# EAGLE board RaspFPGA (EAGLE 6.1), part 1 of 3
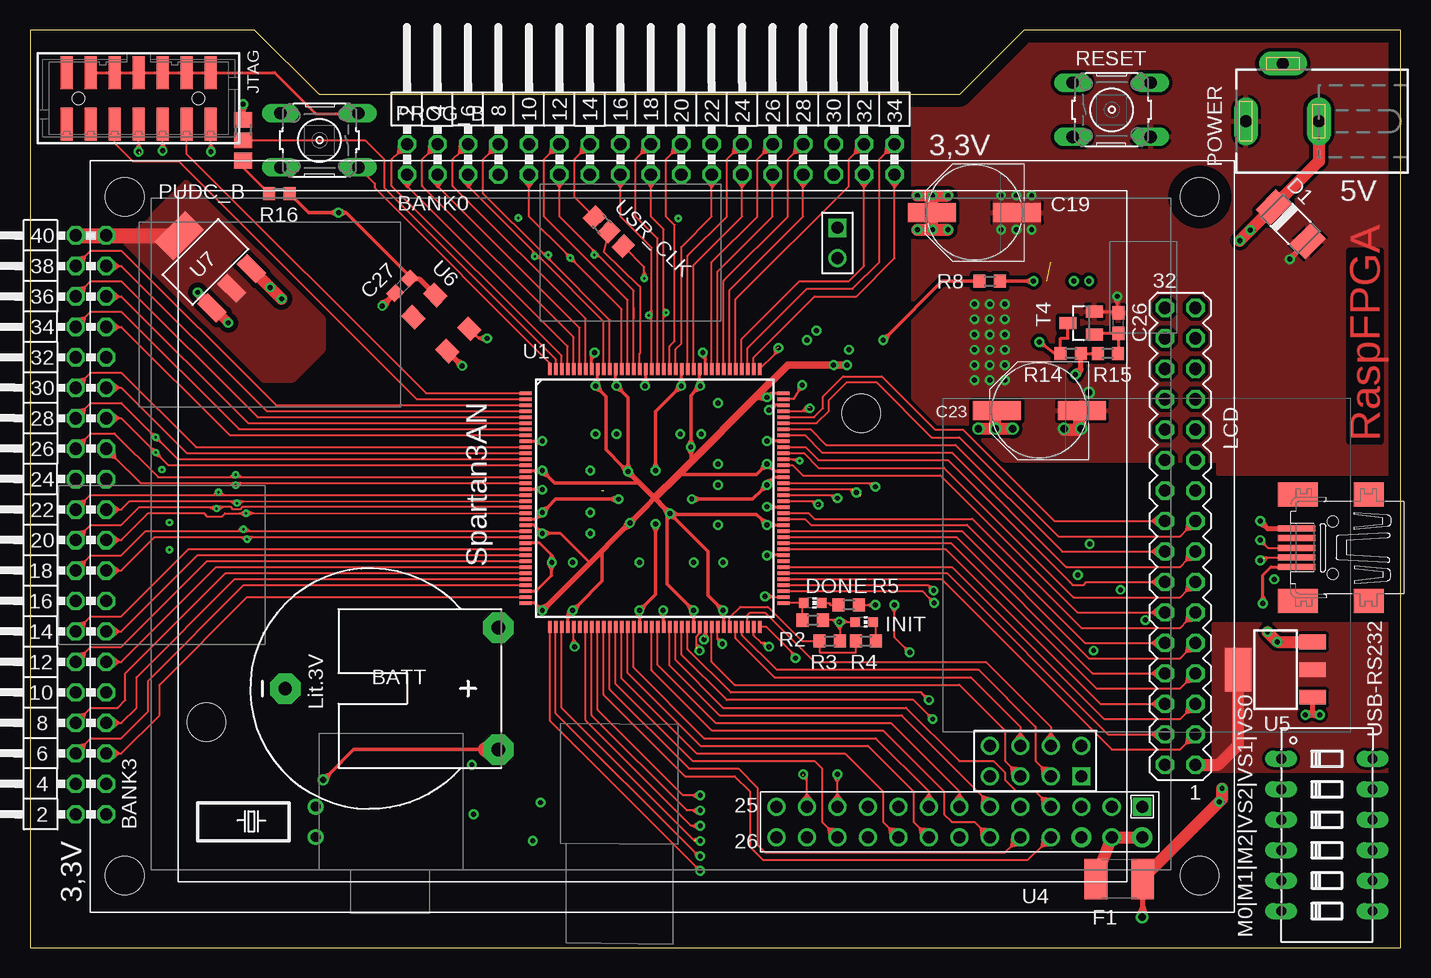
[diagram p5: board, top side]
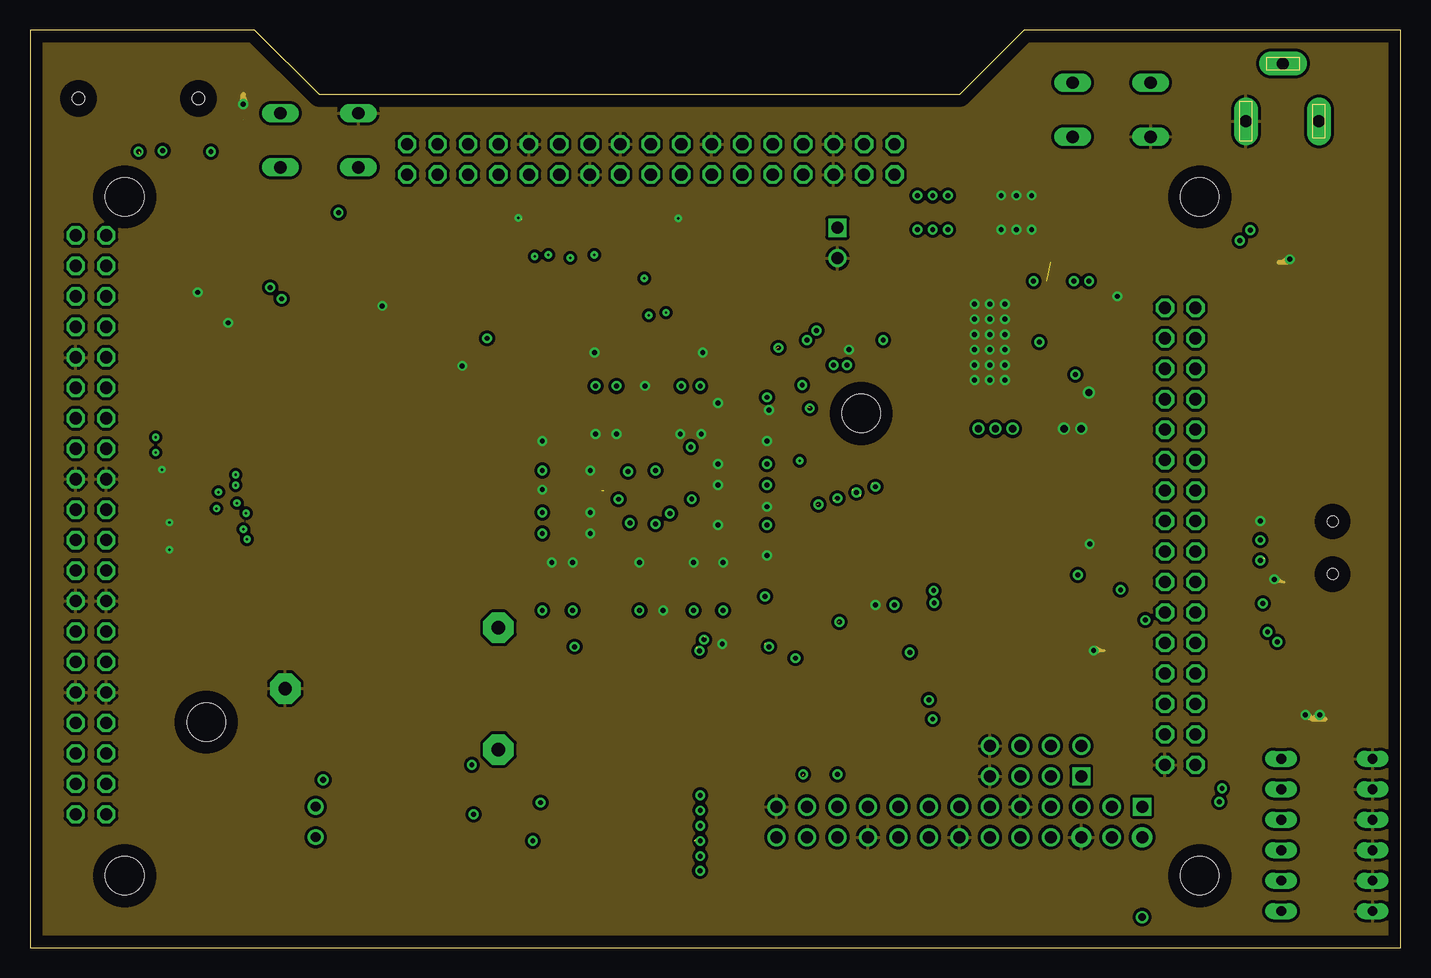
[diagram p6: board, inner layer GND]
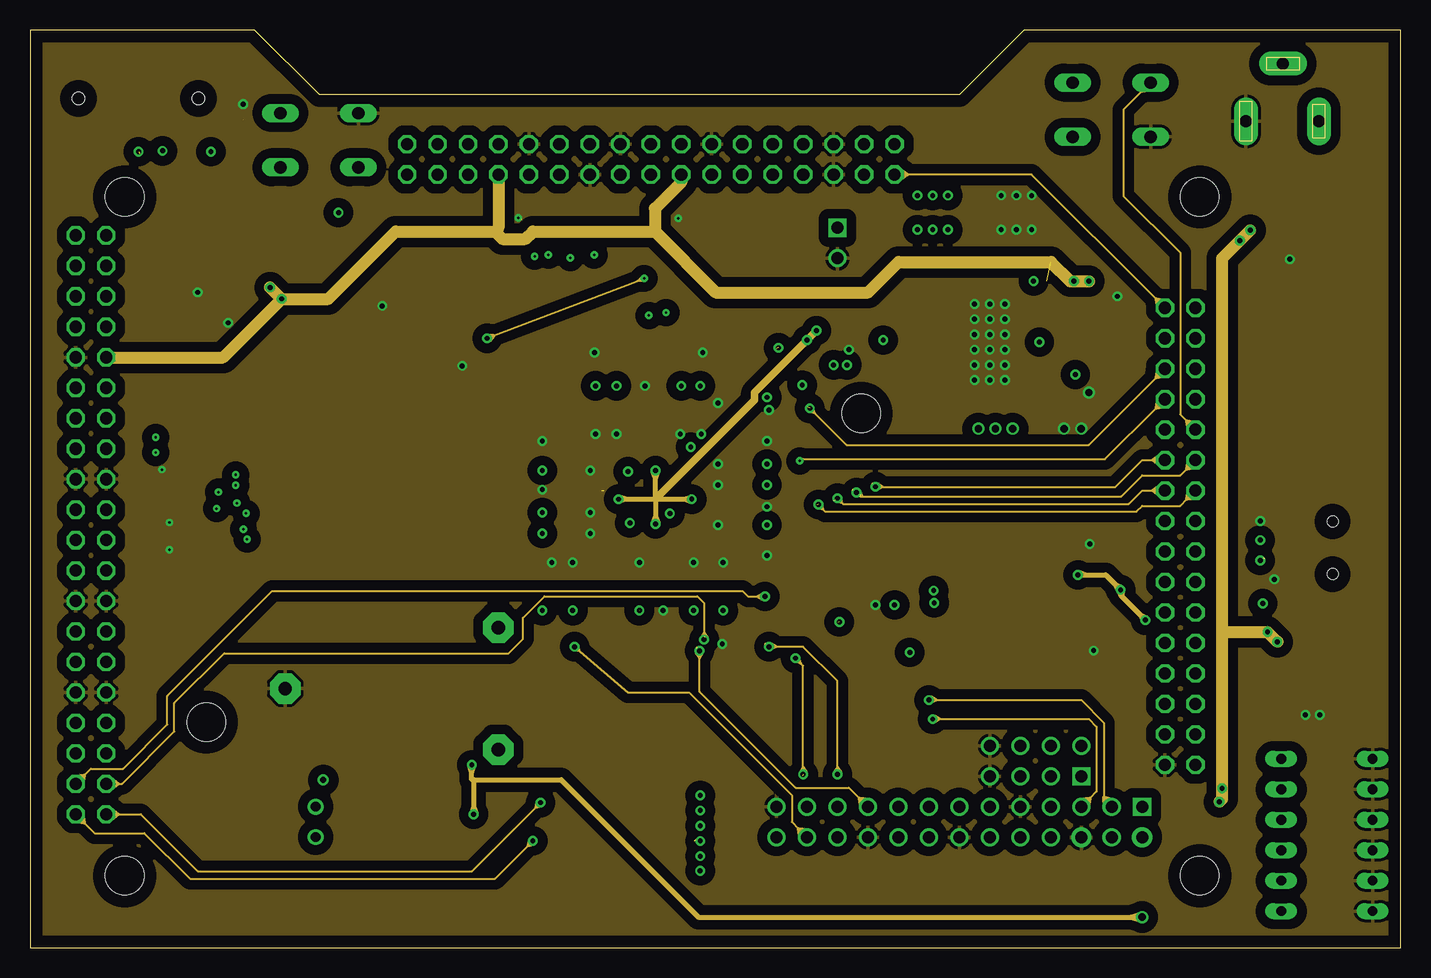
[diagram p7: board, inner layer Signal]
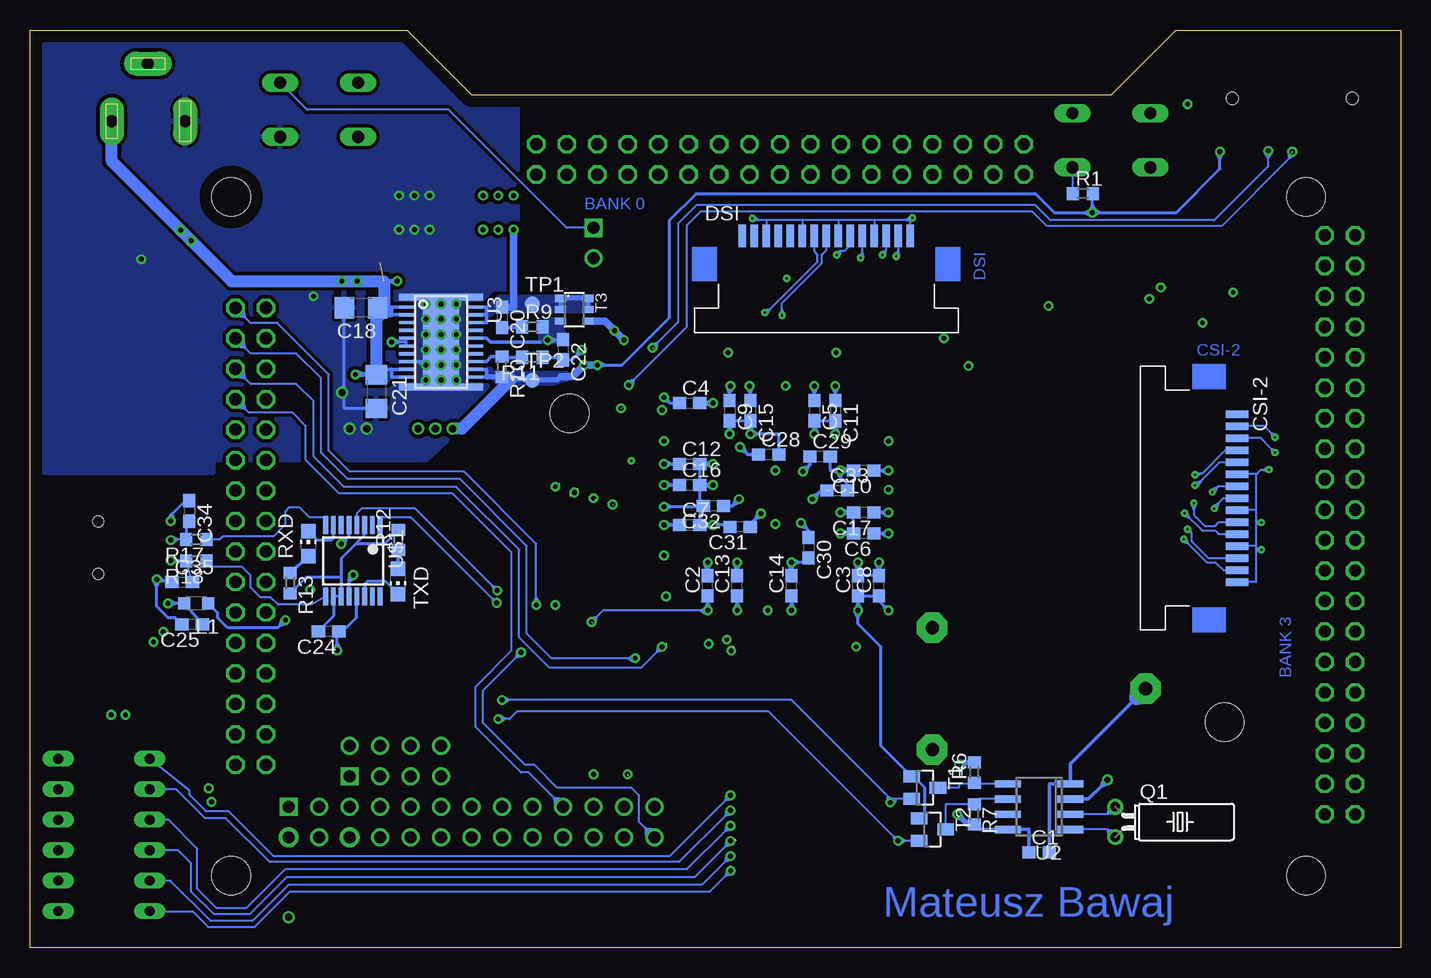
[diagram p8: board, bottom side, seen from below]

Size 114.28 x 76.5 mm. Coordinates in mm from the lower left corner, seen from the top.
Outline: 0,0 114.28,0 114.28,76.5 82.85,76.5 77.47,71.12 24.13,71.12 18.74,76.5 0,76.5 0,0
Copper layers (1*2*15*16): Top 0.035mm / dielectric 0.47mm / GND 0.035mm / dielectric 0.47mm / Signal 0.035mm / dielectric 0.47mm / Bottom 0.035mm
Design rules: minimum track width 5mil, minimum drill 8mil, track to track 5mil, track to pad 5mil, pad to pad 5mil, via to via 5mil, smd to smd 5mil, copper to edge 40mil, drill to drill 8mil, minimum pad ring 10mil, minimum via ring 8mil, stop-mask expansion 4mil, vias tented up to drill 0mil, thermal gap 10mil

## Footprints (pad centres in the part's own frame; a part is rotated, then mirrored left to right if it is on the bottom)
MA17-2W = drill 1.016 octagon: 1 -20.32,-1.27; 2 -20.32,1.27; 3 -17.78,-1.27; 4 -17.78,1.27; 5 -15.24,-1.27; 6 -15.24,1.27; 7 -12.7,-1.27; 8 -12.7,1.27; 9 -10.16,-1.27; 10 -10.16,1.27; 11 -7.62,-1.27; 12 -7.62,1.27; 13 -5.08,-1.27; 14 -5.08,1.27; 15 -2.54,-1.27; 16 -2.54,1.27; 17 0,-1.27; 18 0,1.27; 19 2.54,-1.27; 20 2.54,1.27; 21 5.08,-1.27; 22 5.08,1.27; 23 7.62,-1.27; 24 7.62,1.27; 25 10.16,-1.27; 26 10.16,1.27; 27 12.7,-1.27; 28 12.7,1.27; 29 15.24,-1.27; 30 15.24,1.27; 31 17.78,-1.27; 32 17.78,1.27; 33 20.32,-1.27; 34 20.32,1.27
MA20-2W = drill 1.016 octagon: 1 -24.13,-1.27; 2 -24.13,1.27; 3 -21.59,-1.27; 4 -21.59,1.27; 5 -19.05,-1.27; 6 -19.05,1.27; 7 -16.51,-1.27; 8 -16.51,1.27; 9 -13.97,-1.27; 10 -13.97,1.27; 11 -11.43,-1.27; 12 -11.43,1.27; 13 -8.89,-1.27; 14 -8.89,1.27; 15 -6.35,-1.27; 16 -6.35,1.27; 17 -3.81,-1.27; 18 -3.81,1.27; 19 -1.27,-1.27; 20 -1.27,1.27; 21 1.27,-1.27; 22 1.27,1.27; 23 3.81,-1.27; 24 3.81,1.27; 25 6.35,-1.27; 26 6.35,1.27; 27 8.89,-1.27; 28 8.89,1.27; 29 11.43,-1.27; 30 11.43,1.27; 31 13.97,-1.27; 32 13.97,1.27; 33 16.51,-1.27; 34 16.51,1.27; 35 19.05,-1.27; 36 19.05,1.27; 37 21.59,-1.27; 38 21.59,1.27; 39 24.13,-1.27; 40 24.13,1.27
CR2032H = drill 1.118 pad 2.54 octagon: + 5.08,10.795; +@1 -5.08,10.795; - 0,-6.985
C0603 = smd 1.1 x 1: 1 -0.85,0; 2 0.85,0
C1206 = smd 1.6 x 1.8: 1 -1.4,0; 2 1.4,0
PANASONIC_F = smd 4 x 1.6: + 3.55,0; - -3.55,0
52271-1579 = smd 0.6 x 1.9: P$1 -7,0; P$2 -6,0; P$3 -5,0; P$4 -4,0; P$5 -3,0; P$6 -2,0; P$7 -1,0; P$8 0,0; P$9 1,0; P$10 2,0; P$11 3,0; P$12 4,0; P$13 5,0; P$14 6,0; P$15 7,0
DO-214AC = smd 1.8 x 2.4: A 2.025,0; C -2.025,0
CHIP-LED0603 = smd 0.8 x 0.8: A 0,-0.75; C 0,0.75
L1812 = smd 1.9 x 3.4: 1 -1.95,0; 2 1.95,0
87832-14 = smd 1 x 2.75: 1 -6,-2.15; 2 -6,2.15; 3 -4,-2.15; 4 -4,2.15; 5 -2,-2.15; 6 -2,2.15; 7 0,-2.15; 8 0,2.15; 9 2,-2.15; 10 2,2.15; 11 4,-2.15; 12 4,2.15; 13 6,-2.15; 14 6,2.15 | hole 1: -5,0; 5,0
L2012C = smd 1 x 1: 1 -1,0; 2 1,0
3.2LCD_MODULE = drill 1.016 octagon: 1 -44.45,19.05; 2 -41.91,19.05; 3 -44.45,16.51; 4 -41.91,16.51; 5 -44.45,13.97; 6 -41.91,13.97; 7 -44.45,11.43; 8 -41.91,11.43; 9 -44.45,8.89; 10 -41.91,8.89; 11 -44.45,6.35; 12 -41.91,6.35; 13 -44.45,3.81; 14 -41.91,3.81; 15 -44.45,1.27; 16 -41.91,1.27; 17 -44.45,-1.27; 18 -41.91,-1.27; 19 -44.45,-3.81; 20 -41.91,-3.81; 21 -44.45,-6.35; 22 -41.91,-6.35; 23 -44.45,-8.89; 24 -41.91,-8.89; 25 -44.45,-11.43; 26 -41.91,-11.43; 27 -44.45,-13.97; 28 -41.91,-13.97; 29 -44.45,-16.51; 30 -41.91,-16.51; 31 -44.45,-19.05; 32 -41.91,-19.05 | hole 3.2: -44.806,28.296; -44.806,-28.296; 44.806,28.296; 44.806,-28.296
DIP06YL = drill 0.813 long: 1 -6.35,-3.81; 2 -3.81,-3.81; 3 -1.27,-3.81; 4 1.27,-3.81; 5 3.81,-3.81; 6 6.35,-3.81; 7 6.35,3.81; 8 3.81,3.81; 9 1.27,3.81; 10 -1.27,3.81; 11 -3.81,3.81; 12 -6.35,3.81
DCJ0202 = drill 1 pad 2 long: 1 0,3.1; 2 4.8,0; 3 0,-3
B3F-10XX = drill 1.016 long: 1 -3.251,2.261; 2 3.251,2.261; 3 -3.251,-2.261; 4 3.251,-2.261
A0R-JMP = smd 1.5 x 1.3: 1 0,1.7; 2 0,0; 3 0,-1.7
TC38H = drill 0.813: 1 -1.27,0; 2 1.27,0
R0603 = smd 1 x 1.1: 1 -0.85,0; 2 0.85,0
CHIP-LED0805 = smd 1.2 x 1.2: A 0,-1.05; C 0,1.05
SOT23 = smd 1 x 1.4: 1 -0.95,-1.1; 2 0.95,-1.1; 3 0,1.1
SOT23-6 = smd 0.6 x 0.9: 1 -0.95,-1.15; 2 0,-1.15; 3 0.95,-1.15; 4 0.95,1.15; 5 0,1.15; 6 -0.95,1.15
B1,27 = smd 1.27 x 1.27: PP 0,0
TQ144 = smd 1 x 0.3: 1 -10.75,8.75; 2 -10.75,8.25; 3 -10.75,7.75; 4 -10.75,7.25; 5 -10.75,6.75; 6 -10.75,6.25; 7 -10.75,5.75; 8 -10.75,5.25; 9 -10.75,4.75; 10 -10.75,4.25; 11 -10.75,3.75; 12 -10.75,3.25; 13 -10.75,2.75; 14 -10.75,2.25; 15 -10.75,1.75; 16 -10.75,1.25; 17 -10.75,0.75; 18 -10.75,0.25; 19 -10.75,-0.25; 20 -10.75,-0.75; 21 -10.75,-1.25; 22 -10.75,-1.75; 23 -10.75,-2.25; 24 -10.75,-2.75; 25 -10.75,-3.25; 26 -10.75,-3.75; 27 -10.75,-4.25; 28 -10.75,-4.75; 29 -10.75,-5.25; 30 -10.75,-5.75; 31 -10.75,-6.25; 32 -10.75,-6.75; 33 -10.75,-7.25; 34 -10.75,-7.75; 35 -10.75,-8.25; 36 -10.75,-8.75; 73 10.75,-8.75; 74 10.75,-8.25; 75 10.75,-7.75; 76 10.75,-7.25; 77 10.75,-6.75; 78 10.75,-6.25; 79 10.75,-5.75; 80 10.75,-5.25; 81 10.75,-4.75; 82 10.75,-4.25; 83 10.75,-3.75; 84 10.75,-3.25; 85 10.75,-2.75; 86 10.75,-2.25; 87 10.75,-1.75; 88 10.75,-1.25; 89 10.75,-0.75; 90 10.75,-0.25; 91 10.75,0.25; 92 10.75,0.75; 93 10.75,1.25; 94 10.75,1.75; 95 10.75,2.25; 96 10.75,2.75; 97 10.75,3.25; 98 10.75,3.75; 99 10.75,4.25; 100 10.75,4.75; 101 10.75,5.25; 102 10.75,5.75; 103 10.75,6.25; 104 10.75,6.75; 105 10.75,7.25; 106 10.75,7.75; 107 10.75,8.25; 108 10.75,8.75 | smd 0.3 x 1: 37 -8.75,-10.75; 38 -8.25,-10.75; 39 -7.75,-10.75; 40 -7.25,-10.75; 41 -6.75,-10.75; 42 -6.25,-10.75; 43 -5.75,-10.75; 44 -5.25,-10.75; 45 -4.75,-10.75; 46 -4.25,-10.75; 47 -3.75,-10.75; 48 -3.25,-10.75; 49 -2.75,-10.75; 50 -2.25,-10.75; 51 -1.75,-10.75; 52 -1.25,-10.75; 53 -0.75,-10.75; 54 -0.25,-10.75; 55 0.25,-10.75; 56 0.75,-10.75; 57 1.25,-10.75; 58 1.75,-10.75; 59 2.25,-10.75; 60 2.75,-10.75; 61 3.25,-10.75; 62 3.75,-10.75; 63 4.25,-10.75; 64 4.75,-10.75; 65 5.25,-10.75; 66 5.75,-10.75; 67 6.25,-10.75; 68 6.75,-10.75; 69 7.25,-10.75; 70 7.75,-10.75; 71 8.25,-10.75; 72 8.75,-10.75; 109 8.75,10.75; 110 8.25,10.75; 111 7.75,10.75; 112 7.25,10.75; 113 6.75,10.75; 114 6.25,10.75; 115 5.75,10.75; 116 5.25,10.75; 117 4.75,10.75; 118 4.25,10.75; 119 3.75,10.75; 120 3.25,10.75; 121 2.75,10.75; 122 2.25,10.75; 123 1.75,10.75; 124 1.25,10.75; 125 0.75,10.75; 126 0.25,10.75; 127 -0.25,10.75; 128 -0.75,10.75; 129 -1.25,10.75; 130 -1.75,10.75; 131 -2.25,10.75; 132 -2.75,10.75; 133 -3.25,10.75; 134 -3.75,10.75; 135 -4.25,10.75; 136 -4.75,10.75; 137 -5.25,10.75; 138 -5.75,10.75; 139 -6.25,10.75; 140 -6.75,10.75; 141 -7.25,10.75; 142 -7.75,10.75; 143 -8.25,10.75; 144 -8.75,10.75
SO8 = smd 0.6 x 2.2: 1 -1.905,-2.6; 2 -0.635,-2.6; 3 0.635,-2.6; 4 1.905,-2.6; 5 1.905,2.6; 6 0.635,2.6; 7 -0.635,2.6; 8 -1.905,2.6
HTSSOP24PWP = smd 0.61 x 2.1: 1 -3.745,-2.45; 12 3.745,-2.45; 13 3.745,2.45; 24 -3.745,2.45 | smd 0.27 x 1.2: 2 -2.925,-2.9; 3 -2.275,-2.9; 4 -1.625,-2.9; 5 -0.975,-2.9; 6 -0.325,-2.9; 7 0.325,-2.9; 8 0.975,-2.9; 9 1.625,-2.9; 10 2.275,-2.9; 11 2.925,-2.9; 14 2.925,2.9; 15 2.275,2.9; 16 1.625,2.9; 17 0.975,2.9; 18 0.325,2.9; 19 -0.325,2.9; 20 -0.975,2.9; 21 -1.625,2.9; 22 -2.275,2.9; 23 -2.925,2.9 | smd 8.1 x 3: EXP 0,0
RASPBERRY-PI_REV2 = drill 1 square: P1_1 -41.91,21.59; P5_1 -36.83,19.05; P6_1 -16.51,-26.67 | drill 1 pad 1.676: P1_2 -41.91,24.13; P1_6 -36.83,24.13 | drill 1: P1_3 -39.37,21.59; P1_4 -39.37,24.13; P1_5 -36.83,21.59; P1_7 -34.29,21.59; P1_8 -34.29,24.13; P1_9 -31.75,21.59; P1_10 -31.75,24.13; P1_11 -29.21,21.59; P1_12 -29.21,24.13; P1_13 -26.67,21.59; P1_14 -26.67,24.13; P1_15 -24.13,21.59; P1_16 -24.13,24.13; P1_17 -21.59,21.59; P1_18 -21.59,24.13; P1_19 -19.05,21.59; P1_20 -19.05,24.13; P1_21 -16.51,21.59; P1_22 -16.51,24.13; P1_23 -13.97,21.59; P1_24 -13.97,24.13; P1_25 -11.43,21.59; P1_26 -11.43,24.13; P5_2 -36.83,16.51; P5_3 -34.29,19.05; P5_4 -34.29,16.51; P5_5 -31.75,19.05; P5_6 -31.75,16.51; P5_7 -29.21,19.05; P5_8 -29.21,16.51; P6_2 -16.51,-24.13 | hole 3.2: 36.108,14.535; -18.498,-11.195
SOT223 = smd 1.219 x 2.235: 1 -2.311,-3.099; 2 0,-3.099; 3 2.311,-3.099 | smd 3.6 x 2.2: TAB 0,3.099
FOX924B = smd 1.6 x 1.3: 1 -2,-1.3; 2 2,-1.3; 3 2,1.3; 4 -2,1.3
SSOP16 = smd 0.4 x 1.5: 1 -2.275,-2.981; 2 -1.625,-2.981; 3 -0.975,-2.981; 4 -0.325,-2.981; 5 0.325,-2.981; 6 0.975,-2.981; 7 1.625,-2.981; 8 2.275,-2.981; 9 2.275,2.981; 10 1.625,2.981; 11 0.975,2.981; 12 0.325,2.981; 13 -0.325,2.981; 14 -0.975,2.981; 15 -1.625,2.981; 16 -2.275,2.981
32005-201 = smd 3.1 x 0.5: 1 3,1.6; 2 3,0.8; 3 3,0; 4 3,-0.8; 5 3,-1.6 | smd 2.5 x 2: M1 -3,-4.45; M2 -3,4.45 | smd 3.3 x 2: M3 2.9,4.45; M4 2.9,-4.45 | hole 0.9: 0,2.2; 0,-2.2

## Placement (x,y rotation side)
BANK0  [MA17-2W]  51.75,65.72 0 top
BANK3  [MA20-2W]  5.08,35.24 90 top
BATT  CR2032H  [CR2032H]  28.26,21.59 270 top
C1  100n  [C0603]  30.16,7.94 0 bottom
C2  100n  [C0603]  57.79,30.16 90 bottom
C3  100n  [C0603]  45.24,30.16 90 bottom
C4  100n  [C0603]  59.29,45.4 0 bottom
C5  100n  [C0603]  48.89,44.77 270 bottom
C6  100n  [C0603]  44.77,34.53 180 bottom
C7  100n  [C0603]  59.29,35.24 0 bottom
C8  100n  [C0603]  43.5,30.16 90 bottom
C9  100n  [C0603]  55.96,44.77 270 bottom
C10  100n  [C0603]  44.77,39.77 180 bottom
C11  100n  [C0603]  47.15,44.77 270 bottom
C12  100n  [C0603]  59.29,40.32 0 bottom
C13  100n  [C0603]  55.32,30.16 90 bottom
C14  100n  [C0603]  50.8,30.16 90 bottom
C15  100n  [C0603]  54.21,44.77 270 bottom
C16  100n  [C0603]  59.29,38.58 0 bottom
C17  100n  [C0603]  44.77,36.27 180 bottom
C18  1u  [C1206]  86.68,53.34 180 bottom
C19  22u  [PANASONIC_F]  78.74,61.28 180 top
C20  100n  [C0603]  74.93,52.55 270 bottom
C21  1u  [C1206]  85.41,46.36 270 bottom
C22  100n  [C0603]  69.85,49.85 270 bottom
C23  47u  [PANASONIC_F]  84.14,44.77 180 top
C24  100n  [C0603]  89.38,26.37 180 bottom
C25  10n  [C0603]  100.76,26.95 180 bottom
C26  33n  [C0603]  90.73,52.07 90 top
C27  100n  [C0603]  31.04,55.17 225 top
C28  4.7u  [C0603]  52.7,41.12 0 bottom
C29  4.7u  [C0603]  48.42,40.96 0 bottom
C30  4.7u  [C0603]  49.37,33.34 270 bottom
C31  4.7u  [C0603]  55.09,35.08 180 bottom
C32  4.7u  [C0603]  57.31,36.83 180 bottom
C33  4.7u  [C0603]  46.99,38.1 0 bottom
C34  47p  [C0603]  101,36.4 270 bottom
C35  47p  [C0603]  101.59,30.47 0 bottom
CSI-2  52271-1579  [52271-1579]  13.65,37.47 270 bottom
D1  [DO-214AC]  105.09,60.33 315 top
DONE  [CHIP-LED0603]  65.25,28.73 270 top
DSI  52271-1579  [52271-1579]  47.9,59.33 0 bottom
F1  2A  [L1812]  90.8,5.71 180 top
INIT  [CHIP-LED0603]  69.53,27.15 270 top
JTAG  87832-14  [87832-14]  9.05,70.8 180 top
L1  [L2012C]  100.41,28.69 180 bottom
LCD  3.2LCD_MODULE  [3.2LCD_MODULE]  52.7,34.29 180 top
M0|M1|M2|VS2|VS1|VS0  [DIP06YL]  108.12,9.39 270 top
POWER  +5V  [DCJ0202]  104.46,68.9 90 top
PROG_B  [B3F-10XX]  24.13,67.31 180 top
PUDC_B  0R-JUMPA  [A0R-JMP]  17.78,67.31 0 top
Q1  32.768kHz  [TC38H]  23.81,10.48 270 bottom
R1  4.7k  [R0603]  26.51,62.87 0 bottom
R2  330  [R0603]  65.25,27.3 0 top
R3  4.7k  [R0603]  66.67,25.56 180 top
R4  75  [R0603]  69.69,25.56 180 top
R5  27  [R0603]  68.26,28.57 180 top
R6  4.7k  [R0603]  35.56,14.61 90 bottom
R7  4.7k  [R0603]  35.56,11.11 270 bottom
R8  51.1k  [R0603]  80.01,55.56 0 top
R9  100  [R0603]  72.39,51.75 0 bottom
R10  51.1k  [R0603]  74.93,48.42 270 bottom
R11  30.1k  [R0603]  72.39,49.21 180 bottom
R12  270  [R0603]  83.57,33.98 90 bottom
R13  270  [R0603]  92.58,30.4 270 bottom
R14  5k  [R0603]  86.76,49.53 0 top
R15  100k  [R0603]  89.85,49.53 180 top
R16  4.7k  [R0603]  20.8,62.87 180 top
R17  27  [R0603]  100.41,34.02 180 bottom
R18  27  [R0603]  100.41,32.25 180 bottom
RESET  [B3F-10XX]  90.17,69.85 0 top
RXD  [CHIP-LED0805]  91.08,33.67 0 bottom
T1  BSN20  [SOT23]  39.69,13.33 270 bottom
T2  BSN20  [SOT23]  39.05,9.84 270 bottom
T3  SI3460  [SOT23-6]  68.9,53.18 270 bottom
T4  IRLML6244TR  [SOT23]  87.63,52.07 90 top
TP1  PTR1B1,27  [B1,27]  72.39,53.66 0 bottom
TP2  PTR1B1,27  [B1,27]  72.39,47.31 0 bottom
TXD  [CHIP-LED0805]  83.6,30.53 180 bottom
U1  XC3S50ANTQ144  [TQ144]  52.07,37.47 0 top
U2  DS1307  [SO8]  30.16,11.75 90 bottom
U3  TPS70402  [HTSSOP24PWP]  80.01,50.48 270 bottom
U4  RASPBERRY-PI_REV2  [RASPBERRY-PI_REV2]  50.8,33.34 180 top
U5  LM1117IMPX-3.3  [SOT223]  103.82,23.18 90 top
U6  FOX924B  [FOX924B]  34.29,52.07 315 top
U7  LM1117IMPX-3.3  [SOT223]  14.62,57.17 45 top
U$1  FT230X  [SSOP16]  87.36,32.25 180 bottom
USB-RS232  MINI-USB  [32005-201]  108.58,33.34 180 top
USR_CLK  0R-JUMPA  [A0R-JMP]  48.26,59.69 45 top

## Tracks (layer width: path | path; a pad name or v marks a point on that pad's centre or on a via)
8_BIT_LE  (via drill 0.41)  (1 unrouted)
  Top 0.152: U1.105 64.45,44.72 | 64.45,44.72 64.76,44.72 v65.01,44.97 | 64.45,44.72 64.96,44.64 v65.01,44.97 | 64.45,44.72 64.73,45.15 v65.01,44.97
  Top 0.305: 64.87,45.01 64.67,44.84
  Signal 0.152: v65.01,44.97 65.44,44.54 | 65.44,44.54 68.06,41.91 88.26,41.91 93.9,47.54 LCD.28 | 65.44,44.54 65.33,45.04 v65.01,44.97 | 65.44,44.54 64.94,44.64 v65.01,44.97
  Signal 0.305: 93.9,47.54 94.7,47.66 LCD.28 94.01,48.35 93.9,47.54
+5V  (via drill 0.41, 0.6)  (1 unrouted)
  Top 0.254: R14.2 R15.2
  Top 0.305: v83.66,55.56 83.05,55.56 | 83.05,55.56 R8.2 | 83.05,55.56 | 83.05,55.56 83.56,55.33 | v83.66,55.56 83.56,55.33 | 83.05,55.56 | 83.05,55.56 83.56,55.79 | v83.66,55.56 83.56,55.79 | 83.05,55.56 83.56,55.33 | 83.05,55.56 83.56,55.79 | 83.05,55.56 83.56,55.33 | v83.66,55.56 83.56,55.33 | 83.05,55.56 83.56,55.79 | v83.66,55.56 83.56,55.79
  Top 0.406: R14.2 87.61,48.24 87.58,48.22 | v87.15,47.78 87.58,48.22 | v92.71,2.54 92.75,2.58 92.75,3.44 | 92.75,3.44 F1.1 | 87.58,48.22 87.07,47.97 | 87.07,47.97 | v87.15,47.78 87.07,47.97 | 87.58,48.22 87.34,47.7 | 87.34,47.7 | v87.15,47.78 87.34,47.7 | 87.58,48.22 87.07,47.97 | v87.15,47.78 87.07,47.97 | 87.58,48.22 87.34,47.7 | v87.15,47.78 87.34,47.7 | 92.75,3.44 92.43,2.65 v92.71,2.54 | 92.75,3.44 93,2.63 v92.71,2.54
  Top 1.016: F1.1 92.75,5.76 v99.15,12.15 99.38,12.38 v99.38,13.27 | POWER.3 107.46,65.55 D1.C v101.72,59.81 v100.85,58.94 | U5.3 v103.99,25.49 v103.16,26.31 | U7.3 v20.02,55.04 v20.97,54.09
  Signal 0.406: 36.99,15.08 v36.83,15.24 | 36.99,13.99 44.27,13.99 55.72,2.54 91.81,2.54 | 91.81,2.54 v92.71,2.54 | v36.83,15.24 37.03,15.22 | v36.83,15.24 36.66,15.12 | v36.99,11.11 37.17,11.2 | v36.99,11.11 36.9,10.93 | 36.83,14.63 36.83,13.99 36.99,13.99 | 36.83,14.63 v36.83,15.24 | 36.99,13.99 36.99,11.72 | 36.99,11.72 v36.99,11.11 | v100.85,58.94 | 36.83,14.63 37.02,15.17 v36.83,15.24 | 36.83,14.63 36.64,15.17 v36.83,15.24 | 36.99,11.72 36.8,11.18 v36.99,11.11 | 36.99,11.72 37.18,11.18 v36.99,11.11 | 91.81,2.54 92.61,2.82 | 91.81,2.54 92.61,2.26 | 92.61,2.26 | v92.71,2.54 92.61,2.26 | 91.81,2.54 92.61,2.82 | v92.71,2.54 92.61,2.82 | 91.81,2.54 92.61,2.26 | v92.71,2.54 92.61,2.26 | 91.81,2.54 92.61,2.82 | v92.71,2.54 92.61,2.82
  Signal 1.016: 99.38,26.31 99.38,12.38 v99.15,12.15 | 99.38,26.31 99.38,57.47 v100.85,58.94 v101.72,59.81 | 99.38,26.31 v103.16,26.31 v103.99,25.49 | v20.97,54.09 24.87,54.09 30.5,59.71 38.75,59.71 | 38.75,59.71 39.39,59.08 41.29,59.08 41.93,59.71 52.09,59.71 | 52.09,59.71 57.17,54.63 69.87,54.63 72.41,57.17 85.11,57.17 86.71,55.56 v87.01,55.56 v88.28,55.56 | v20.97,54.09 v20.02,55.04 | BANK0.7 39.05,60.01 38.75,59.71 | BANK0.19 54.29,63.82 52.09,61.62 52.09,59.71 | BANK3.31 16.1,49.21 v20.97,54.09
  Bottom 0.254: 84.69,52.76 84.77,52.84 84.77,53.02
  Bottom 0.305: C1.1 31.01,9.84 U2.8 35.14,9.84 R7.2 | U3.11 84.14,47.56 84.14,48.21 | 84.14,48.21 U3.10 | U3.2 84.14,53.41 84.14,52.76 U3.3 | 84.77,55.56 84.27,55.56 | 84.27,55.56 v83.66,55.56 | 84.14,48.21 85.35,48.21 85.41,48.26 | 84.27,55.56 83.77,55.79 | v83.66,55.56 83.77,55.79 | 84.27,55.56 83.77,55.33 | v83.66,55.56 83.77,55.33 | 84.27,55.56 83.77,55.79 | 84.27,55.56 83.77,55.33 | 84.27,55.56 83.77,55.79 | v83.66,55.56 83.77,55.79 | 84.27,55.56 83.77,55.33 | v83.66,55.56 83.77,55.33
  Bottom 0.406: 86.54,47.78 85.88,47.78 85.41,48.26 | 86.54,47.78 v87.15,47.78 | 36.26,15.46 36.61,15.46 v36.83,15.24 | 36.26,15.46 R6.2 | 36.56,10.68 36.14,10.26 R7.2 | 36.56,10.68 v36.99,11.11 | 84.14,52.76 84.69,52.76 C18.1 | 86.54,47.78 87.09,47.59 | v87.15,47.78 87.09,47.59 | 86.54,47.78 87.09,47.98 | v87.15,47.78 87.09,47.98 | 86.54,47.78 87.09,47.59 | 86.54,47.78 87.09,47.98 | 86.54,47.78 87.09,47.59 | v87.15,47.78 87.09,47.59 | 86.54,47.78 87.09,47.98 | v87.15,47.78 87.09,47.98 | 36.26,15.46 36.7,15.08 v36.83,15.24 | 36.26,15.46 36.83,15.44 v36.83,15.24 | 36.56,10.68 37.08,10.93 v36.99,11.11 | 36.56,10.68 36.81,11.2 v36.99,11.11
  Bottom 1.016: C21.1 85.41,48.26 85.41,52.39 84.77,53.02 84.77,55.56 97.47,55.56 v100.85,58.94 v101.72,59.81 107.46,65.55 POWER.3
  pour Bottom (no thermals): 84.14,47.47 84.61,47.15 86.04,47.15 86.04,48.26 84.14,48.26
AWAKE  (via drill 0.41)  (1 unrouted)
  Top 0.152: 56.32,26.27 56.32,25.8 v56.2,25.68 | 56.32,26.27 U1.63 | v56.2,25.68 56.34,25.45 56.32,25.34 56.24,25.41 v56.2,25.68 | v56.2,25.68 56.28,25.84 56.38,25.86 56.36,25.76 v56.2,25.68 | 56.32,26.27 55.96,25.91 v56.2,25.68 | 56.32,26.27 56.51,25.8 v56.2,25.68
  Top 0.305: 56.26,26.09 56.19,25.9
  Signal 0.152: 7.37,13.65 7.68,13.65 12.04,18.01 12.04,20.38 16.19,24.54 39.91,24.54 41.1,25.72 41.1,27.5 42.88,29.28 55.64,29.28 56.2,28.73 56.2,26.29 | 56.2,26.29 | 56.2,26.29 v56.2,25.68 | 56.2,26.29 | 56.2,26.29 55.92,25.86 | v56.2,25.68 55.92,25.86 | 56.2,26.29 56.47,25.86 | v56.2,25.68 56.47,25.86 | 56.2,26.29 55.92,25.86 | 56.2,26.29 56.47,25.86 | 56.2,26.29 55.92,25.86 | v56.2,25.68 55.92,25.86 | 56.2,26.29 56.47,25.86 | v56.2,25.68 56.47,25.86
  Signal 0.305: 7.37,13.65 6.72,14.14 | 7.37,13.65 | 7.37,13.65 6.72,13.16 | 7.37,13.65 6.72,14.14 | BANK3.3 6.72,14.14 | 7.37,13.65 6.72,13.16 | BANK3.3 6.72,13.16 | 7.37,13.65 6.72,14.14 | BANK3.3 6.72,14.14 | 7.37,13.65 6.72,13.16 | BANK3.3 6.72,13.16
CAM1_CN  (via drill 0.2)
  Top 0.152: 4.53,34.69 5.08,35.24 7.62,35.24 9.09,36.72 14.92,36.72 | 14.92,36.72 15.27,36.72 | 15.27,36.72 15.36,36.72 | U1.20 17.7,36.72 17.52,36.53 16.94,36.53 16.75,36.72 16.14,36.72 | 16.14,36.72 15.84,36.72 | 15.84,36.72 15.56,36.72 v15.56,36.61 15.45,36.72 15.36,36.72 | 14.92,36.72 15.34,36.53 | 14.92,36.72 15.31,36.78 | 15.31,36.78 15.45,36.81 | 16.14,36.72 15.66,36.81 | 16.14,36.72 15.86,36.57 | 15.86,36.57 15.77,36.53 | 15.27,36.72 15.34,36.53 | v15.56,36.61 15.34,36.53 | 15.27,36.72 15.45,36.81 | v15.56,36.61 15.45,36.81 | 15.84,36.72 15.66,36.81 | v15.56,36.61 15.66,36.81 | 15.84,36.72 15.77,36.53 | v15.56,36.61 15.77,36.53 | v15.56,36.61 15.41,36.43 15.26,36.57 15.37,36.73 v15.56,36.61 | 15.31,36.78 15.33,36.58 v15.56,36.61 | 15.31,36.78 15.51,36.83 v15.56,36.61 | v15.56,36.61 15.61,36.83 15.81,36.78 15.78,36.58 v15.56,36.61 | 15.86,36.57 15.74,36.74 v15.56,36.61 | 15.86,36.57 15.71,36.44 v15.56,36.61
  Top 0.305: 4.53,34.69 3.72,34.58 BANK3.20 4.41,33.89 4.53,34.69
  Bottom 0.152: CSI-2.P$8 14.8,37.47 15.22,37.04 | v15.56,36.61 15.22,37.04 | 15.22,37.04 15.33,36.63 v15.56,36.61 | 15.22,37.04 15.56,36.83 v15.56,36.61 | v15.56,36.61 15.33,36.65 15.37,36.85 15.57,36.83 v15.56,36.61 | v15.56,36.61 15.33,36.56 15.3,36.76 15.49,36.82 v15.56,36.61 | v15.56,36.61 15.36,36.72 15.46,36.89 15.65,36.82 v15.56,36.61
CAM1_CP  (via drill 0.2)
  Top 0.152: 4.53,37.23 5.01,37.72 15.29,37.72 | 15.29,37.72 15.57,37.72 | 15.57,37.72 15.72,37.72 | 15.72,37.72 15.87,37.72 | 15.87,37.72 16.14,37.72 | 16.14,37.72 U1.18 | 15.72,37.72 v15.72,37.98 | 15.29,37.72 15.76,37.76 | 15.29,37.72 15.5,37.91 | 16.14,37.72 15.99,37.85 | 15.99,37.85 15.93,37.91 | 16.14,37.72 15.67,37.76 | 15.57,37.72 15.76,37.76 | v15.72,37.98 15.76,37.76 | 15.57,37.72 15.5,37.91 | v15.72,37.98 15.5,37.91 | 15.87,37.72 15.93,37.91 | v15.72,37.98 15.93,37.91 | 15.87,37.72 15.67,37.76 | v15.72,37.98 15.67,37.76 | v15.72,37.98 15.73,37.75 15.53,37.74 15.49,37.93 v15.72,37.98 | v15.72,37.98 15.63,37.77 15.44,37.85 15.5,38.05 v15.72,37.98 | 15.99,37.85 15.94,38.05 v15.72,37.98 | 15.99,37.85 15.81,37.77 v15.72,37.98 | v15.72,37.98 15.94,37.93 15.9,37.74 15.7,37.75 v15.72,37.98
  Top 0.305: 4.53,37.23 3.72,37.12 BANK3.22 4.41,36.43 4.53,37.23
  Bottom 0.152: v15.72,37.98 15.31,38.4 | 15.31,38.4 15.23,38.47 CSI-2.P$7 | 15.31,38.4 15.49,38 v15.72,37.98 | 15.31,38.4 15.59,38.26 | 15.59,38.26 15.7,38.21 v15.72,37.98 | v15.72,37.98 15.49,38 15.5,38.2 15.7,38.21 v15.72,37.98 | v15.72,37.98 15.5,37.91 15.44,38.11 15.62,38.19 v15.72,37.98 | 15.59,38.26 15.51,38.08 v15.72,37.98 | 15.59,38.26 15.79,38.2 v15.72,37.98
CAM1_DN0  (via drill 0.2)
  Top 0.152: 7.37,31.43 7.62,31.43 10.4,34.22 17.61,34.22 | 18.1,34.22 18.35,34.22 | 18.35,34.22 18.55,34.22 | 18.55,34.22 U1.25 | 17.61,34.22 17.84,34.22 | 17.84,34.22 18.1,34.22 | 18.1,34.22 v18.1,34.05 | 18.55,34.22 18.33,34.25 | 18.33,34.25 18.16,34.27 | 18.55,34.22 18.32,34.02 | 17.61,34.22 17.79,34.08 | 17.79,34.08 17.87,34.02 | 17.61,34.22 18.03,34.27 | 18.35,34.22 18.16,34.27 | v18.1,34.05 18.16,34.27 | 18.35,34.22 18.32,34.02 | v18.1,34.05 18.32,34.02 | 17.84,34.22 17.87,34.02 | v18.1,34.05 17.87,34.02 | 17.84,34.22 18.03,34.27 | v18.1,34.05 18.03,34.27 | 18.33,34.25 18.13,34.28 v18.1,34.05 | 18.33,34.25 18.33,34.05 v18.1,34.05 | v18.1,34.05 18.25,34.22 18.4,34.08 18.28,33.92 v18.1,34.05 | 17.79,34.08 17.91,33.92 v18.1,34.05 | 17.79,34.08 17.94,34.22 v18.1,34.05 | v18.1,34.05 17.87,34.05 17.86,34.25 18.06,34.28 v18.1,34.05
  Top 0.305: 7.37,31.43 6.72,31.92 | 7.37,31.43 | 7.37,31.43 6.72,30.95 | 7.37,31.43 6.72,31.92 | BANK3.17 6.72,31.92 | 7.37,31.43 6.72,30.95 | BANK3.17 6.72,30.95 | 7.37,31.43 6.72,31.92 | BANK3.17 6.72,31.92 | 7.37,31.43 6.72,30.95 | BANK3.17 6.72,30.95
  Bottom 0.152: CSI-2.P$14 14.8,31.46 15.46,32.13 16.17,32.13 17.7,33.66 | v18.1,34.05 17.88,33.84 | 17.88,33.84 17.7,33.66 | 17.7,33.66 18.08,33.82 | v18.1,34.05 18.08,33.82 | 17.7,33.66 17.87,34.04 | 17.88,33.84 18.08,33.82 | v18.1,34.05 18.08,33.82 | 17.88,33.84 17.87,34.04 | v18.1,34.05 17.87,34.04 | v18.1,34.05 18.16,33.83 17.97,33.78 17.89,33.96 v18.1,34.05 | v18.1,34.05 18,33.84 17.82,33.93 17.88,34.12 v18.1,34.05
CAM1_DN1  (via drill 0.2)
  Top 0.152: 7.37,33.97 7.62,33.97 9.86,36.22 14.48,36.22 14.73,35.96 16.01,35.96 16.25,36.21 17.71,36.21 | 17.71,36.21 v18.02,36.21 | v18.02,36.21 U1.21 | 17.85,36.05 17.47,36.21 17.85,36.36 v18.02,36.21 | v18.02,36.21 17.85,36.05 | 18.3,36.32 18.66,36.21 18.19,36.05 | 18.3,36.32 18.19,36.36 | 17.71,36.21 17.85,36.05 | v18.02,36.21 17.85,36.05 | 17.71,36.21 17.85,36.36 v18.02,36.21 | 18.19,36.36 18.32,36.21 18.19,36.05 | v18.02,36.21 18.19,36.36 | v18.02,36.21 18.19,36.05 | v18.02,36.21 17.91,36 17.73,36.1 17.81,36.29 v18.02,36.21 | v18.02,36.21 17.8,36.12 17.73,36.31 17.91,36.41 v18.02,36.21 | 18.3,36.32 18.12,36.41 v18.02,36.21 | 18.3,36.32 18.23,36.13 v18.02,36.21 | v18.02,36.21 18.23,36.28 18.3,36.09 18.12,36 v18.02,36.21
  Top 0.305: 7.37,33.97 6.72,34.46 | 7.37,33.97 | 7.37,33.97 6.72,33.49 | 7.37,33.97 6.72,34.46 | BANK3.19 6.72,34.46 | 7.37,33.97 6.72,33.49 | BANK3.19 6.72,33.49 | 7.37,33.97 6.72,34.46 | BANK3.19 6.72,34.46 | 7.37,33.97 6.72,33.49 | BANK3.19 6.72,33.49
  Bottom 0.152: CSI-2.P$11 15.18,34.47 15.48,34.77 16.57,34.77 v18.02,36.21 | 17.9,35.92 17.53,35.72 17.79,36.19 | 17.9,35.92 18,35.98 | 18,35.98 17.8,35.99 17.79,36.19 | v18.02,36.21 18,35.98 | v18.02,36.21 17.79,36.19 | 17.9,35.92 18.09,35.99 v18.02,36.21 | 17.9,35.92 17.81,36.1 v18.02,36.21 | v18.02,36.21 17.92,36 17.74,36.09 17.8,36.28 v18.02,36.21
CAM1_DP0  (via drill 0.2)
  Top 0.152: 4.53,32.15 5.08,32.7 7.62,32.7 9.63,34.72 17.3,34.72 | 17.79,34.72 18.05,34.72 | 18.05,34.72 18.29,34.72 | 18.29,34.72 U1.24 | 17.3,34.72 17.54,34.72 | 17.54,34.72 17.79,34.72 | 17.79,34.72 v17.79,34.89 | 18.29,34.72 18.1,34.86 | 18.1,34.86 18.02,34.92 | 18.29,34.72 17.85,34.66 | 17.3,34.72 17.56,34.68 | 17.56,34.68 17.73,34.66 | 17.3,34.72 17.49,34.86 | 17.49,34.86 17.57,34.92 | 18.05,34.72 18.02,34.92 | v17.79,34.89 18.02,34.92 | 18.05,34.72 17.85,34.66 | v17.79,34.89 17.85,34.66 | 17.54,34.72 17.73,34.66 | v17.79,34.89 17.73,34.66 | 17.54,34.72 17.57,34.92 | v17.79,34.89 17.57,34.92 | 18.1,34.86 17.98,35.02 v17.79,34.89 | 18.1,34.86 17.95,34.72 v17.79,34.89 | v17.79,34.89 18.02,34.89 18.02,34.68 17.82,34.66 v17.79,34.89 | 17.56,34.68 17.76,34.66 v17.79,34.89 | 17.56,34.68 17.56,34.89 v17.79,34.89 | 17.49,34.86 17.64,34.72 v17.79,34.89 | 17.49,34.86 17.61,35.02 v17.79,34.89
  Top 0.305: 4.53,32.15 3.72,32.04 BANK3.18 4.41,31.35 4.53,32.15
  Bottom 0.152: v17.79,34.89 17.93,34.72 | v17.79,34.89 17.57,34.68 | 17.57,34.68 17.47,34.58 | 17.47,34.58 17.46,34.55 17.46,33.89 16.03,32.47 CSI-2.P$13 | 17.47,34.58 17.78,34.66 v17.79,34.89 | 17.47,34.58 17.52,34.74 | 17.52,34.74 17.56,34.87 v17.79,34.89 | 17.57,34.68 17.77,34.66 v17.79,34.89 | 17.57,34.68 17.56,34.88 v17.79,34.89 | v17.79,34.89 17.84,34.66 17.64,34.62 17.58,34.81 v17.79,34.89 | 17.52,34.74 17.71,34.67 v17.79,34.89 | 17.52,34.74 17.57,34.94 v17.79,34.89
CAM1_DP1  (via drill 0.2)
  Top 0.152: 7.37,36.51 7.62,36.51 8.32,37.22 16.7,37.22 | 16.7,37.22 16.99,37.22 | 16.99,37.22 17.26,37.22 | 17.26,37.22 17.52,37.21 | 17.52,37.21 17.76,37.21 | 17.76,37.21 U1.19 | 17.26,37.22 v17.26,37.07 | 16.7,37.22 16.95,37.07 | 16.95,37.07 17.03,37.02 | 16.7,37.22 17.18,37.28 | 17.76,37.21 17.5,37.25 | 17.5,37.25 17.33,37.28 v17.26,37.07 | 17.76,37.21 17.56,37.07 | 17.56,37.07 17.48,37.02 v17.26,37.07 | 16.99,37.22 17.03,37.02 | v17.26,37.07 17.03,37.02 | 16.99,37.22 17.18,37.28 | v17.26,37.07 17.18,37.28 | 17.52,37.21 17.33,37.28 v17.26,37.07 | 17.52,37.21 17.48,37.01 v17.26,37.07 | 16.95,37.07 17.08,36.91 v17.26,37.07 | 16.95,37.07 17.09,37.22 v17.26,37.07 | v17.26,37.07 17.03,37.06 17.02,37.26 17.22,37.29 v17.26,37.07 | 17.5,37.25 17.3,37.29 v17.26,37.07 | 17.5,37.25 17.48,37.05 v17.26,37.07 | 17.56,37.07 17.42,37.22 v17.26,37.07 | 17.56,37.07 17.43,36.92 v17.26,37.07
  Top 0.305: 7.37,36.51 6.72,37 | 7.37,36.51 | 7.37,36.51 6.72,36.03 | 7.37,36.51 6.72,37 | BANK3.21 6.72,37 | 7.37,36.51 6.72,36.03 | BANK3.21 6.72,36.03 | 7.37,36.51 6.72,37 | BANK3.21 6.72,37 | 7.37,36.51 6.72,36.03 | BANK3.21 6.72,36.03
  Bottom 0.152: CSI-2.P$10 15.18,35.47 15.48,35.16 16.36,35.16 17.25,36.05 17.25,36.49 | 17.25,36.76 17.25,36.86 17.26,36.89 v17.26,37.07 | 17.25,36.76 17.25,36.49 | 17.25,36.49 17.36,36.78 | 17.36,36.78 17.41,36.89 | 17.25,36.49 17.15,36.78 | 17.15,36.78 17.1,36.89 | 17.25,36.76 17.41,36.89 | v17.26,37.07 17.41,36.89 | 17.25,36.76 17.1,36.89 | v17.26,37.07 17.1,36.89 | 17.36,36.78 17.46,36.96 v17.26,37.07 | 17.36,36.78 17.17,36.85 v17.26,37.07 | 17.15,36.78 17.34,36.85 v17.26,37.07 | 17.15,36.78 17.05,36.96 v17.26,37.07
CAM_CLK  (via drill 0.2)
  Top 0.152: 4.53,42.31 5.08,42.86 7.03,42.86 10.67,39.22 16.64,39.22 | 17.14,39.22 17.63,39.23 | 17.63,39.23 U1.15 | 16.64,39.22 16.91,39.22 | 16.91,39.22 17.14,39.22 | 17.14,39.22 v17.14,39.41 | 17.63,39.23 17.37,39.42 v17.14,39.41 | 17.63,39.23 17.37,39.2 | 17.37,39.2 17.18,39.18 v17.14,39.41 | 16.64,39.22 17.11,39.18 | 16.64,39.22 16.84,39.36 | 16.84,39.36 16.92,39.42 | v17.14,39.41 17.37,39.42 17.38,39.22 17.18,39.19 v17.14,39.41 | 16.91,39.22 17.11,39.18 | v17.14,39.41 17.11,39.18 | 16.91,39.22 16.92,39.42 | v17.14,39.41 16.92,39.42 | v17.14,39.41 17.34,39.53 17.45,39.36 17.29,39.23 v17.14,39.41 | 17.37,39.2 17.37,39.4 v17.14,39.41 | 17.37,39.2 17.17,39.18 v17.14,39.41 | v17.14,39.41 17.13,39.18 16.93,39.2 16.92,39.4 v17.14,39.41 | 16.84,39.36 17,39.23 v17.14,39.41 | 16.84,39.36 16.95,39.53 v17.14,39.41
  Top 0.305: 4.53,42.31 3.72,42.2 BANK3.26 4.41,41.51 4.53,42.31
  Bottom 0.152: CSI-2.P$4 14.62,41.47 16.55,39.53 16.67,39.53 | 16.87,39.53 17.15,39.53 v17.14,39.41 | 16.87,39.53 16.67,39.53 | 16.67,39.53 16.84,39.41 | 16.84,39.41 16.93,39.34 | 16.67,39.53 16.89,39.58 | 16.89,39.58 17.05,39.62 | 16.87,39.53 16.93,39.34 | v17.14,39.41 16.93,39.34 | 16.87,39.53 17.05,39.62 | v17.14,39.41 17.05,39.62 | 16.84,39.41 16.98,39.26 v17.14,39.41 | 16.84,39.41 16.97,39.56 v17.14,39.41 | 16.89,39.58 16.92,39.38 v17.14,39.41 | 16.89,39.58 17.09,39.63 v17.14,39.41
CAM_GPIO  (via drill 0.2)
  Top 0.152: 7.07,40.87 9.23,38.72 16.67,38.72 | 17.14,38.72 17.39,38.72 | 17.39,38.72 17.61,38.72 | 17.61,38.72 U1.16 | 16.67,38.72 16.9,38.72 | 16.9,38.72 17.14,38.72 | 17.14,38.72 v17.14,38.54 | 17.61,38.72 17.2,38.76 | 17.61,38.72 17.45,38.58 | 17.45,38.58 17.37,38.51 | 16.67,38.72 16.84,38.58 | 16.84,38.58 16.92,38.51 | 16.67,38.72 17.09,38.76 | 17.39,38.72 17.2,38.76 | v17.14,38.54 17.2,38.76 | 17.39,38.72 17.37,38.51 | v17.14,38.54 17.37,38.51 | 16.9,38.72 16.92,38.51 | v17.14,38.54 16.92,38.51 | 16.9,38.72 17.09,38.76 | v17.14,38.54 17.09,38.76 | v17.14,38.54 17.17,38.76 17.37,38.74 17.37,38.54 v17.14,38.54 | 17.45,38.58 17.29,38.71 v17.14,38.54 | 17.45,38.58 17.33,38.41 v17.14,38.54 | 16.84,38.58 16.96,38.41 v17.14,38.54 | 16.84,38.58 16.99,38.71 v17.14,38.54 | v17.14,38.54 16.92,38.54 16.92,38.74 17.12,38.76 v17.14,38.54
  Top 0.305: 7.07,40.87 6.95,41.68 BANK3.25 6.26,40.99 7.07,40.87
  Bottom 0.152: CSI-2.P$5 15.08,40.47 16.83,38.72 16.65,38.89 | 16.97,38.78 17.16,38.72 v17.14,38.54 | 16.97,38.78 16.65,38.89 | 16.65,38.89 16.92,38.51 v17.14,38.54 | 16.65,38.89 17.09,38.76 v17.14,38.54 | 16.97,38.78 16.92,38.59 v17.14,38.54 | 16.97,38.78 17.17,38.76 v17.14,38.54 | v17.14,38.54 16.94,38.43 16.85,38.61 17.02,38.73 v17.14,38.54 | v17.14,38.54 16.93,38.6 16.98,38.79 17.18,38.76 v17.14,38.54
CAM_SCL0  (via drill 0.2)
  Top 0.152: v10.48,41.28 10.69,41.06 | 10.69,41.06 10.9,40.85 | 10.9,40.85 11.54,40.22 U1.13 | 7.37,44.13 7.62,44.13 10.06,41.69 | 10.06,41.69 10.26,41.49 | 10.26,41.49 v10.48,41.28 | 10.9,40.85 10.76,41.15 | 10.76,41.15 10.71,41.26 | 10.9,40.85 10.6,41 | 10.6,41 10.49,41.05 | 10.06,41.69 10.25,41.29 | 10.06,41.69 10.35,41.55 | 10.35,41.55 10.46,41.5 | 10.69,41.06 10.71,41.26 | v10.48,41.28 10.71,41.26 | 10.69,41.06 10.49,41.05 | v10.48,41.28 10.49,41.05 | 10.26,41.49 10.25,41.29 | v10.48,41.28 10.25,41.29 | 10.26,41.49 10.46,41.5 | v10.48,41.28 10.46,41.5 | 10.76,41.15 10.69,41.35 v10.48,41.28 | 10.76,41.15 10.57,41.07 v10.48,41.28 | 10.6,41 10.68,41.18 v10.48,41.28 | 10.6,41 10.41,41.06 v10.48,41.28 | v10.48,41.28 10.26,41.21 10.2,41.4 10.38,41.48 v10.48,41.28 | 10.35,41.55 10.27,41.37 v10.48,41.28 | 10.35,41.55 10.55,41.49 v10.48,41.28
  Top 0.305: 7.37,44.13 6.72,44.62 | 7.37,44.13 | 7.37,44.13 6.72,43.65 | 7.37,44.13 6.72,44.62 | BANK3.27 6.72,44.62 | 7.37,44.13 6.72,43.65 | BANK3.27 6.72,43.65 | 7.37,44.13 6.72,44.62 | BANK3.27 6.72,44.62 | 7.37,44.13 6.72,43.65 | BANK3.27 6.72,43.65
  Bottom 0.152: CSI-2.P$3 11.67,42.47 10.82,41.62 | v10.48,41.28 10.69,41.49 | 10.69,41.49 10.82,41.62 | 10.82,41.62 10.62,41.55 | 10.62,41.55 10.49,41.5 | 10.82,41.62 10.75,41.41 | 10.75,41.41 10.71,41.29 | 10.69,41.49 10.49,41.5 | v10.48,41.28 10.49,41.5 | 10.69,41.49 10.71,41.29 | v10.48,41.28 10.71,41.29 | 10.62,41.55 10.42,41.5 v10.48,41.28 | 10.62,41.55 10.69,41.36 v10.48,41.28 | 10.75,41.41 10.56,41.49 v10.48,41.28 | 10.75,41.41 10.7,41.22 v10.48,41.28
CAM_SDA0  (via drill 0.2)
  Top 0.152: 4.53,44.85 5.08,45.4 7.62,45.4 10.07,42.95 | v10.48,42.55 10.69,42.33 | 10.69,42.33 10.88,42.14 | 10.88,42.14 12.31,40.72 U1.12 | 10.07,42.95 10.26,42.76 | 10.26,42.76 v10.48,42.55 | 10.88,42.14 10.71,42.53 | 10.88,42.14 10.49,42.32 | 10.07,42.95 10.25,42.56 | 10.07,42.95 10.46,42.77 | 10.69,42.33 10.71,42.53 | v10.48,42.55 10.71,42.53 | 10.69,42.33 10.49,42.32 | v10.48,42.55 10.49,42.32 | 10.26,42.76 10.25,42.56 | v10.48,42.55 10.25,42.56 | 10.26,42.76 10.46,42.77 | v10.48,42.55 10.46,42.77 | v10.48,42.55 10.7,42.61 10.76,42.42 10.57,42.34 v10.48,42.55 | v10.48,42.55 10.69,42.45 10.6,42.27 10.41,42.33 v10.48,42.55 | v10.48,42.55 10.26,42.48 10.2,42.67 10.38,42.75 v10.48,42.55 | v10.48,42.55 10.27,42.64 10.35,42.82 10.55,42.76 v10.48,42.55
  Top 0.305: 4.53,44.85 3.72,44.74 BANK3.28 4.41,44.05 4.53,44.85
  Bottom 0.152: CSI-2.P$2 11.4,43.47 10.86,42.93 | v10.48,42.55 10.69,42.76 | 10.69,42.76 10.86,42.93 | 10.86,42.93 10.61,42.82 | 10.61,42.82 10.49,42.77 | 10.49,42.77 | 10.86,42.93 10.71,42.56 | 10.71,42.56 | 10.69,42.76 10.49,42.77 | v10.48,42.55 10.49,42.77 | 10.69,42.76 10.71,42.56 | v10.48,42.55 10.71,42.56 | 10.61,42.82 10.41,42.76 v10.48,42.55 | 10.61,42.82 10.69,42.64 v10.48,42.55 | v10.48,42.55 10.57,42.75 10.75,42.67 10.7,42.48 v10.48,42.55
CS  (via drill 0.41)  (1 unrouted)
  Top 0.152: U1.90 65.17,37.22 | 65.17,37.22 65.5,37.22 v65.72,36.95 | 65.17,37.22 65.44,36.78 v65.72,36.95 | 65.17,37.22 65.68,37.28 v65.72,36.95
  Top 0.305: 65.61,36.89 65.37,37.15
  Signal 0.152: v65.72,36.95 66.14,36.5 | 66.14,36.5 | 66.14,36.5 66.28,36.35 92.23,36.35 92.71,36.83 95.88,36.83 96.44,37.38 LCD.19 | 66.14,36.5 66.05,37.01 | 66.05,37.01 | 66.14,36.5 | 66.14,36.5 65.64,36.63 | 66.14,36.5 66.05,37.01 | 66.05,37.01 | v65.72,36.95 66.05,37.01 | 66.14,36.5 65.64,36.63 | v65.72,36.95 65.64,36.63 | 66.14,36.5 66.05,37.01 | v65.72,36.95 66.05,37.01 | 66.14,36.5 65.64,36.63 | v65.72,36.95 65.64,36.63
  Signal 0.305: 96.44,37.38 97.24,37.5 LCD.19 96.55,38.19 96.44,37.38
DONE
  Top 0.152: 64.48,28.71 U1.73 | R2.1 64.4,28.73
  Top 0.254: 64.48,28.71 arc90 DONE.A 64.4,28.73
DSI_CN  (via drill 0.2)
  Top 0.152: 41.59,63.44 41.59,60.96 44.67,57.88 | 41.59,63.44 | 41.59,63.44 BANK0.9 | v45.05,57.51 44.83,57.72 | 44.83,57.72 44.67,57.88 | U1.132 49.32,53.23 45.43,57.12 | 45.43,57.12 45.26,57.29 | 45.26,57.29 v45.05,57.51 | 44.67,57.88 44.77,57.64 | 44.77,57.64 44.82,57.52 | 44.67,57.88 44.91,57.78 | 44.91,57.78 45.03,57.74 | 45.43,57.12 45.27,57.49 | 45.43,57.12 45.06,57.28 | 44.83,57.72 44.82,57.52 | v45.05,57.51 44.82,57.52 | 44.83,57.72 45.03,57.74 | v45.05,57.51 45.03,57.74 | 45.26,57.29 45.27,57.49 | v45.05,57.51 45.27,57.49 | 45.26,57.29 45.06,57.28 | v45.05,57.51 45.06,57.28 | 44.77,57.64 44.83,57.44 v45.05,57.51 | 44.77,57.64 44.96,57.72 v45.05,57.51 | 44.91,57.78 44.84,57.6 v45.05,57.51 | 44.91,57.78 45.11,57.73 v45.05,57.51 | v45.05,57.51 45.26,57.57 45.32,57.38 45.14,57.3 v45.05,57.51 | v45.05,57.51 45.25,57.42 45.17,57.23 44.98,57.29 v45.05,57.51
  Top 0.305: 41.59,63.44 42.08,64.09 | BANK0.9 42.08,64.09 | 41.59,63.44 | 41.59,63.44 41.1,64.09 | BANK0.9 41.1,64.09 | 41.59,63.44 42.08,64.09 | BANK0.9 42.08,64.09 | 41.59,63.44 41.1,64.09 | BANK0.9 41.1,64.09 | 41.59,63.44 42.08,64.09 | BANK0.9 42.08,64.09 | 41.59,63.44 41.1,64.09 | BANK0.9 41.1,64.09
  Bottom 0.152: 44.9,57.78 44.9,57.65 v45.05,57.51 | 44.9,57.78 44.9,57.98 | 44.9,57.98 DSI.P$11 | 44.9,57.98 44.86,57.75 | 44.86,57.75 44.83,57.59 | 44.9,57.98 45.1,57.73 | 44.9,57.78 44.83,57.59 | v45.05,57.51 44.83,57.59 | 44.9,57.78 45.1,57.73 | v45.05,57.51 45.1,57.73 | 44.86,57.75 44.82,57.55 v45.05,57.51 | 44.86,57.75 45.06,57.74 v45.05,57.51 | v45.05,57.51 44.89,57.67 45.03,57.81 45.19,57.68 v45.05,57.51
DSI_CP  (via drill 0.2)
  Top 0.152: 47.46,57.63 50.32,54.77 50.32,53.34 | 47.46,57.63 47.33,57.76 | 47.33,57.76 47.17,57.92 | 47.17,57.92 47.04,58.05 | 47.04,58.05 46.93,58.16 | 46.93,58.16 44.13,60.96 44.13,63.44 | 44.13,63.44 | 44.13,63.44 BANK0.11 | U1.130 50.32,53.34 | 50.32,53.34 50.32,52.47 | 47.17,57.92 v47.03,57.75 | 47.46,57.63 47.33,57.76 | 47.33,57.76 47.19,57.9 | 47.46,57.63 47.21,57.6 | 46.93,58.16 46.91,58.02 | 46.91,58.02 46.89,57.92 | 46.93,58.16 47.05,58.05 | 47.05,58.05 47.19,57.91 | 47.33,57.76 47.19,57.9 | v47.03,57.75 47.19,57.9 | 47.33,57.76 47.21,57.6 | v47.03,57.75 47.21,57.6 | 47.04,58.05 46.89,57.92 | v47.03,57.75 46.89,57.92 | 47.04,58.05 47.19,57.91 | v47.03,57.75 47.19,57.91 | 47.33,57.76 47.19,57.91 v47.03,57.75 | 47.33,57.76 47.21,57.6 v47.03,57.75 | v47.03,57.75 47.25,57.81 47.3,57.61 47.12,57.53 v47.03,57.75 | 46.91,58.02 46.82,57.84 v47.03,57.75 | 46.91,58.02 47.1,57.96 v47.03,57.75 | 47.05,58.05 46.89,57.92 v47.03,57.75 | 47.05,58.05 47.19,57.91 v47.03,57.75
  Top 0.254: U1.130
  Top 0.305: 44.13,63.44 44.62,64.09 | BANK0.11 44.62,64.09 | 44.13,63.44 | 44.13,63.44 43.64,64.09 | BANK0.11 43.64,64.09 | 44.13,63.44 44.62,64.09 | BANK0.11 44.62,64.09 | 44.13,63.44 43.64,64.09 | BANK0.11 43.64,64.09 | 44.13,63.44 44.62,64.09 | BANK0.11 44.62,64.09 | 44.13,63.44 43.64,64.09 | BANK0.11 43.64,64.09
  Bottom 0.152: DSI.P$10 45.9,58.55 46.35,58.1 46.67,58.1 46.68,58.1 | v47.03,57.75 46.82,57.96 | 46.82,57.96 46.68,58.1 | 46.68,58.1 46.76,57.89 | 46.76,57.89 46.8,57.76 v47.03,57.75 | 46.68,58.1 47.02,57.97 v47.03,57.75 | 46.82,57.96 46.8,57.76 v47.03,57.75 | 46.82,57.96 47.02,57.97 v47.03,57.75 | 46.76,57.89 46.81,57.69 v47.03,57.75 | 46.76,57.89 46.95,57.96 v47.03,57.75 | v47.03,57.75 46.82,57.83 46.9,58.02 47.09,57.97 v47.03,57.75
DSI_DN0  (via drill 0.2)
  Top 0.152: 49.21,63.44 49.21,60.96 51.82,58.35 51.82,53.09 | 49.21,63.44 | 49.21,63.44 BANK0.15 | 51.82,52.71 51.82,53.09 | U1.127 51.82,52.3 | 51.82,52.3 51.82,52.5 | 51.82,52.5 51.82,52.71 | 51.82,52.71 v51.59,52.71 | 51.82,53.09 51.62,52.93 | v51.59,52.71 51.62,52.93 | 51.82,53.09 51.82,52.91 | 51.82,52.91 51.82,52.71 | v51.59,52.71 51.82,52.71 | 51.82,52.3 51.82,52.5 | 51.82,52.5 51.82,52.7 | 51.82,52.3 51.69,52.42 | 51.69,52.42 51.62,52.48 | 51.62,52.93 51.82,52.91 51.82,52.71 | v51.59,52.71 51.62,52.93 | v51.59,52.71 51.82,52.71 | 51.82,52.5 51.82,52.7 | v51.59,52.71 51.82,52.7 | 51.82,52.5 51.62,52.48 | v51.59,52.71 51.62,52.48 | v51.59,52.71 51.51,52.92 51.7,52.99 51.79,52.82 v51.59,52.71 | 51.82,52.91 51.62,52.93 v51.59,52.71 | 51.82,52.91 51.82,52.71 v51.59,52.71 | 51.82,52.5 51.82,52.7 v51.59,52.71 | 51.82,52.5 51.62,52.48 v51.59,52.71 | 51.69,52.42 51.79,52.59 v51.59,52.71 | 51.69,52.42 51.5,52.49 v51.59,52.71
  Top 0.305: 49.21,63.44 49.7,64.09 | BANK0.15 49.7,64.09 | 49.21,63.44 | 49.21,63.44 48.72,64.09 | BANK0.15 48.72,64.09 | 49.21,63.44 49.7,64.09 | BANK0.15 49.7,64.09 | 49.21,63.44 48.72,64.09 | BANK0.15 48.72,64.09 | 49.21,63.44 49.7,64.09 | BANK0.15 49.7,64.09 | 49.21,63.44 48.72,64.09 | BANK0.15 48.72,64.09
  Bottom 0.152: DSI.P$8 47.9,58.14 48.26,57.79 48.26,57.07 51.58,53.75 51.58,53.2 | 51.58,53.01 51.58,52.72 v51.59,52.71 | 51.58,53.01 51.58,53.2 | 51.58,53.2 51.49,52.99 | 51.49,52.99 51.44,52.87 | 51.58,53.2 51.68,53 | 51.68,53 51.74,52.88 | 51.58,53.01 51.44,52.87 | v51.59,52.71 51.44,52.87 | 51.58,53.01 51.74,52.88 | v51.59,52.71 51.74,52.88 | 51.49,52.99 51.39,52.82 v51.59,52.71 | 51.49,52.99 51.68,52.92 v51.59,52.71 | 51.68,53 51.5,52.91 v51.59,52.71 | 51.68,53 51.79,52.83 v51.59,52.71
DSI_DN1  (via drill 0.2)
  Top 0.152: BANK0.5 36.51,63.5 36.57,63.44 41.91,58.1 | U1.135 47.82,52.19 42.59,57.43 | 42.23,57.79 42.08,57.93 | 42.08,57.93 41.91,58.1 | 42.23,57.79 v42.07,57.63 | 42.59,57.43 42.37,57.64 | 42.37,57.64 42.23,57.79 | 41.91,58.1 41.92,57.8 | 41.91,58.1 42.23,57.79 | 42.59,57.43 42.37,57.65 | 42.37,57.65 42.23,57.79 v42.07,57.63 | 42.59,57.43 42.25,57.48 v42.07,57.63 | 42.08,57.93 41.92,57.8 | v42.07,57.63 41.92,57.8 | 42.08,57.93 42.23,57.79 | v42.07,57.63 42.23,57.79 | 42.37,57.64 42.23,57.79 v42.07,57.63 | 42.37,57.64 42.25,57.49 v42.07,57.63 | v42.07,57.63 41.85,57.7 41.92,57.89 42.12,57.85 v42.07,57.63 | v42.07,57.63 41.93,57.8 42.08,57.93 42.23,57.79 v42.07,57.63 | 42.37,57.65 42.23,57.79 v42.07,57.63 | 42.37,57.65 42.25,57.49 v42.07,57.63 | v42.07,57.63 42.29,57.67 42.33,57.47 42.14,57.41 v42.07,57.63
  Top 0.305: 36.57,63.44 37.02,64.12 BANK0.5 36.05,64.06 36.57,63.44
  Bottom 0.152: 41.9,57.88 41.9,57.79 v42.07,57.63 | 41.9,57.88 41.89,58.14 | 41.89,58.14 DSI.P$14 | 41.89,58.14 41.85,57.69 v42.07,57.63 | 41.89,58.14 42.1,57.85 v42.07,57.63 | 41.9,57.88 41.85,57.69 v42.07,57.63 | 41.9,57.88 42.1,57.85 v42.07,57.63 | v42.07,57.63 41.84,57.65 41.86,57.85 42.07,57.86 v42.07,57.63 | v42.07,57.63 41.9,57.79 42.05,57.93 42.21,57.81 v42.07,57.63
DSI_DP0  (via drill 0.2)
  Top 0.152: 51.75,63.44 51.75,60.96 52.82,59.89 52.82,53.29 | 51.75,63.44 | 51.75,63.44 BANK0.17 | U1.125 52.82,52.55 | 52.82,52.55 52.82,52.72 | 52.82,52.72 52.82,52.94 | 52.82,52.94 v53.02,52.94 | 52.82,52.94 52.82,53.17 | 52.82,53.17 52.82,53.29 | 52.82,52.55 52.94,52.65 | 52.94,52.65 53.02,52.71 | 52.82,52.55 52.8,52.92 | 52.82,53.29 52.81,53.16 | 52.81,53.16 52.8,52.97 | 52.82,53.29 52.92,53.23 | 52.92,53.23 53.02,53.17 | 52.82,52.72 53.02,52.71 | v53.02,52.94 53.02,52.71 | 52.82,52.72 52.8,52.92 | v53.02,52.94 52.8,52.92 | 52.82,53.17 52.8,52.97 | v53.02,52.94 52.8,52.97 | 52.82,53.17 53.02,53.17 | v53.02,52.94 53.02,53.17 | 52.94,52.65 53.12,52.74 v53.02,52.94 | 52.94,52.65 52.83,52.82 v53.02,52.94 | v53.02,52.94 53.01,52.72 52.81,52.73 52.79,52.93 v53.02,52.94 | 52.81,53.16 52.79,52.96 v53.02,52.94 | 52.81,53.16 53.01,53.17 v53.02,52.94 | 52.92,53.23 52.82,53.05 v53.02,52.94 | 52.92,53.23 53.11,53.16 v53.02,52.94
  Top 0.305: 51.75,63.44 52.24,64.09 | BANK0.17 52.24,64.09 | 51.75,63.44 | 51.75,63.44 51.26,64.09 | BANK0.17 51.26,64.09 | 51.75,63.44 52.24,64.09 | BANK0.17 52.24,64.09 | 51.75,63.44 51.26,64.09 | BANK0.17 51.26,64.09 | 51.75,63.44 52.24,64.09 | BANK0.17 52.24,64.09 | 51.75,63.44 51.26,64.09 | BANK0.17 51.26,64.09
  Bottom 0.152: DSI.P$7 48.9,58.11 48.62,57.75 48.62,57.19 52.59,53.22 | v53.02,52.94 52.9,52.94 52.75,53.08 | 52.75,53.08 52.59,53.22 | 52.59,53.22 52.8,52.89 v53.02,52.94 | 52.59,53.22 52.83,53.18 | 52.83,53.18 52.94,53.16 v53.02,52.94 | 52.75,53.08 52.8,52.88 v53.02,52.94 | 52.75,53.08 52.94,53.16 v53.02,52.94 | v53.02,52.94 52.82,52.83 52.72,53.01 52.89,53.13 v53.02,52.94 | 52.83,53.18 52.8,52.98 v53.02,52.94 | 52.83,53.18 53.03,53.17 v53.02,52.94
DSI_DP1  (via drill 0.2)
  Top 0.152: BANK0.8 38.33,66.27 37.78,65.72 37.78,62.87 42.77,57.88 | U1.134 48.32,52.33 43.31,57.34 | 43.31,57.34 43.21,57.44 | 43.21,57.44 43.04,57.61 | 43.04,57.61 42.92,57.73 | 42.92,57.73 42.77,57.88 | 43.04,57.61 v43.22,57.75 | 43.31,57.34 43.34,57.46 | 43.34,57.46 43.36,57.57 | 43.31,57.34 43.06,57.58 | 43.06,57.58 | v43.22,57.75 43.06,57.58 | 42.77,57.88 42.92,57.73 | 42.92,57.73 43.05,57.59 | v43.22,57.75 43.05,57.59 | 42.77,57.88 43.04,57.89 | 43.21,57.44 43.36,57.57 | v43.22,57.75 43.36,57.57 | 43.21,57.44 43.06,57.58 | v43.22,57.75 43.06,57.58 | 42.92,57.73 43.05,57.59 | v43.22,57.75 43.05,57.59 | 42.92,57.73 43.04,57.89 | v43.22,57.75 43.04,57.89 | 43.34,57.46 43.43,57.65 v43.22,57.75 | 43.34,57.46 43.15,57.53 v43.22,57.75 | v43.22,57.75 43.36,57.57 43.2,57.44 43.06,57.58 v43.22,57.75 | 42.92,57.73 43.06,57.59 v43.22,57.75 | 42.92,57.73 43.04,57.89 v43.22,57.75 | v43.22,57.75 43,57.69 42.95,57.89 43.14,57.96 v43.22,57.75
  Top 0.305: 38.33,66.27 39.14,66.39 BANK0.8 38.45,67.08 38.33,66.27
  Bottom 0.152: DSI.P$13 42.9,58.1 42.91,58.09 | v43.22,57.75 42.91,58.09 | 42.91,58.09 42.99,57.77 v43.22,57.75 | 42.91,58.09 43.22,57.97 v43.22,57.75 | v43.22,57.75 42.99,57.77 43.02,57.97 43.22,57.97 v43.22,57.75 | v43.22,57.75 42.99,57.7 42.96,57.9 43.15,57.96 v43.22,57.75 | v43.22,57.75 43.01,57.84 43.09,58.02 43.29,57.96 v43.22,57.75
EXT3,3V
  Top 1.27: BANK3.40 BANK3.39 12.43,59.37 U7.TAB
  pour Top (isolate 0.406, no thermals): 7.95,58.76 19.38,47.33 21.92,47.33 24.46,49.87 24.46,52.41 13.03,63.84
EXT_CLK
  Top 0.152: BANK0.14 45.95,66.27 45.4,65.72 45.4,62.55 USR_CLK.1
  Top 0.305: 45.95,66.27 46.76,66.39 BANK0.14 46.07,67.08 45.95,66.27
FT232_VCCIO
  Bottom 0.254: U$1.3 86.38,34.41 87.12,33.67 | 87.12,33.67 88.33,32.46 88.33,30.86 | 88.33,30.86 U$1.11 U$1.10 88.98,27.66 90.23,26.41 C24.2 | R12.2 84.74,33.67 87.12,33.67 | R13.2 91.27,30.86 88.33,30.86
GND  (via drill 0.2, 0.41, 0.6)  (2 unrouted)
  Top 0.152: R5.1 69.88,28.57 | 69.88,28.57 | 69.88,28.57 v70.48,28.57 | 57.32,25.79 57.32,25.71 v57.71,25.32 | 57.32,25.79 U1.65 | 69.88,28.57 | 69.88,28.57 70.31,28.3 | v70.48,28.57 70.31,28.3 | 69.88,28.57 70.31,28.85 | v70.48,28.57 70.31,28.85 | 69.88,28.57 70.31,28.3 | 69.88,28.57 70.31,28.85 | 69.88,28.57 70.31,28.3 | v70.48,28.57 70.31,28.3 | 69.88,28.57 70.31,28.85 | v70.48,28.57 70.31,28.85 | 57.32,25.79 57.38,25.28 v57.71,25.32 | 57.32,25.79 57.81,25.63 v57.71,25.32
  Top 0.254: U1.17 42.1,38.22 | 42.1,38.22 42.67,38.22 v42.7,38.18 | U1.56 52.82,27.49 | 52.82,27.49 52.82,28.06 v52.78,28.1 | U1.128 51.32,47.44 | 51.32,47.44 51.32,46.88 v51.28,46.83 | 62.04,36.72 61.47,36.72 v61.44,36.75 | 62.04,36.72 U1.89 | v61.44,42.23 61.45,42.22 62.05,42.22 | U1.100 62.05,42.22 | U1.81 62.05,32.72 | 62.05,32.72 61.44,32.72 v61.44,32.7 | U1.9 42.09,42.22 | 42.09,42.22 42.7,42.22 v42.7,42.23 | U1.137 46.82,49.05 | 46.82,49.05 46.82,49.36 v47.07,49.61 | U1.118 56.32,49.05 | 56.32,49.05 56.32,49.41 v56.08,49.61 | U1.34 42.2,29.71 C8.2 43.5,31.5 | 43.5,31.5 v43.5,32.11 | JTAG.11 JTAG.9 JTAG.7 JTAG.5 JTAG.3 JTAG.1 20.4,72.95 23.81,69.53 27.38,69.53 PROG_B.3 | U1.26 42.48,33.72 43.48,32.72 | 43.48,32.72 43.5,32.7 v43.5,32.11 | T4.2 90.73,53.02 C26.2 | 90.65,53.02 90.65,53.68 | 90.65,53.68 v90.65,54.29 | U1.106 62.05,45.22 | 62.05,45.22 62,45.22 v61.59,44.81 | 42.1,38.22 42.56,37.94 v42.7,38.18 | 42.1,38.22 42.59,38.44 v42.7,38.18 | 52.82,27.49 53.04,27.98 v52.78,28.1 | 52.82,27.49 52.54,27.96 v52.78,28.1 | 51.32,47.44 51.04,46.98 v51.28,46.83 | 51.32,47.44 51.53,46.94 v51.28,46.83 | 62.04,36.72 61.58,36.99 v61.44,36.75 | 62.04,36.72 61.55,36.5 v61.44,36.75 | 43.5,31.5 43.75,31.98 | 43.75,31.98 | 43.5,31.5 43.25,31.98 | 43.25,31.98 | 43.5,31.5 43.75,31.98 | 43.75,31.98 | 43.5,31.5 43.25,31.98 | v43.5,32.11 43.25,31.98 | 43.5,31.5 43.75,31.98 | v43.5,32.11 43.75,31.98 | 43.5,31.5 43.25,31.98 | v43.5,32.11 43.25,31.98 | 43.48,32.72 43.25,32.23 v43.5,32.11 | 43.48,32.72 43.74,32.24 v43.5,32.11 | 62.05,45.22 61.52,45.08 v61.59,44.81 | 62.05,45.22 61.86,44.71 v61.59,44.81 | 62.05,42.22 61.57,42.47 v61.44,42.23 | 62.05,42.22 61.56,41.98 v61.44,42.23
  Top 0.254: 62.05,32.72 61.56,32.95 v61.44,32.7 | 62.05,32.72 61.57,32.46 v61.44,32.7 | 42.09,42.22 42.58,41.98 v42.7,42.23 | 42.09,42.22 42.57,42.47 v42.7,42.23 | 46.82,49.05 47.24,49.39 v47.07,49.61 | 46.82,49.05 46.79,49.59 v47.07,49.61 | 56.32,49.05 56.36,49.59 v56.08,49.61 | 56.32,49.05 55.9,49.39 v56.08,49.61 | 90.65,53.68 90.89,54.16 | 90.89,54.16 | 90.65,53.68 90.4,54.16 | 90.4,54.16 | 90.65,53.68 90.89,54.16 | 90.89,54.16 | 90.65,53.68 90.4,54.16 | v90.65,54.29 90.4,54.16 | 90.65,53.68 90.89,54.16 | v90.65,54.29 90.89,54.16 | 90.65,53.68 90.4,54.16 | v90.65,54.29 90.4,54.16
  Top 0.406: USB-RS232.5 103.17,34.94 102.98,35.13 | v102.55,35.56 102.98,35.13 | v17.78,70.33 17.78,69.72 | 17.78,69.72 PUDC_B.1 | 105.45,57.82 v105.02,57.39 v105.01,57.39 | 105.45,57.82 D1.A | 106.92,19.41 106.92,19.53 | 106.92,19.53 106.92,19.56 | 106.92,19.56 U5.1 | v106.32,19.41 106.9,19.41 | 106.9,19.41 106.92,19.41 | C27.2 29.8,53.93 | 29.8,53.93 v29.37,53.5 | U6.2 v36.04,48.5 | 106.92,19.41 106.93,19.41 | 106.93,19.41 v107.51,19.41 | v107.51,19.41 | 29.8,53.93 29.28,53.68 | v29.37,53.5 29.28,53.68 | 105.45,57.82 104.93,57.57 | 104.93,57.57 | v105.01,57.39 104.93,57.57 | 105.45,57.82 105.2,57.3 | 105.2,57.3 | v105.01,57.39 105.2,57.3 | 106.9,19.41 106.93,19.4 | 106.93,19.4 107.44,19.22 | 102.98,35.13 102.74,35.65 v102.55,35.56 | 102.98,35.13 102.46,35.38 v102.55,35.56 | 35.6,48.93 35.85,48.41 | v36.04,48.5 35.85,48.41 | 35.6,48.93 35.85,48.41 | v36.04,48.5 35.85,48.41 | 35.6,48.93 36.12,48.68 v36.04,48.5 | 29.8,53.93 29.28,53.68 | 29.28,53.68 | 29.8,53.93 | 29.8,53.93 29.55,53.41 | v29.37,53.5 29.55,53.41 | 29.8,53.93 29.55,53.41 | 29.55,53.41 | 29.8,53.93 29.28,53.68 | v29.37,53.5 29.28,53.68 | 29.8,53.93 29.55,53.41 | v29.37,53.5 29.55,53.41 | 17.78,69.72 17.97,70.26 | v17.78,70.33 17.97,70.26 | 17.78,69.72 17.59,70.26 | v17.78,70.33 17.59,70.26 | 17.78,69.72 17.97,70.26 | 17.78,69.72 17.59,70.26 | 17.78,69.72 17.97,70.26 | v17.78,70.33 17.97,70.26 | 17.78,69.72 17.59,70.26 | v17.78,70.33 17.59,70.26 | 105.45,57.82 104.93,57.57 | v105.01,57.39 104.93,57.57 | 105.45,57.82 105.2,57.3 | v105.01,57.39 105.2,57.3 | 106.9,19.42 106.39,19.6 | v106.32,19.41 106.39,19.6 | 106.9,19.4 106.39,19.22 | v106.32,19.41 106.39,19.22 | 106.92,19.53 106.35,19.61 v106.32,19.41 | 106.92,19.53 106.43,19.23 v106.32,19.41
  Top 0.406: 106.93,19.41 106.9,19.42 | 106.93,19.41 106.9,19.4 | 106.93,19.41 106.9,19.42 | 106.9,19.42 106.39,19.6 | v106.32,19.41 106.39,19.6 | 106.93,19.41 106.9,19.4 | 106.9,19.4 106.39,19.22 | v106.32,19.41 106.39,19.22 | 106.93,19.4 106.4,19.6 v106.32,19.41 | 106.93,19.4 106.39,19.21 v106.32,19.41 | v106.32,19.41 106.39,19.6 106.93,19.42 106.4,19.22 v106.32,19.41 | 106.9,19.41 107.44,19.22 | v107.51,19.41 107.44,19.22 | 106.9,19.41 107.44,19.6 | v107.51,19.41 107.44,19.6 | v107.51,19.41 107.4,19.23 106.91,19.53 107.48,19.61 v107.51,19.41 | v107.51,19.41 107.41,19.23 106.91,19.53 107.48,19.61 v107.51,19.41 | 106.9,19.42 107.44,19.22 v107.51,19.41 | 106.9,19.42 107.45,19.6 v107.51,19.41 | 106.9,19.4 107.45,19.21 v107.51,19.41 | 106.9,19.4 107.44,19.6 v107.51,19.41 | 106.92,19.56 107.4,19.24 v107.51,19.41 | 106.92,19.56 107.49,19.61 v107.51,19.41 | 106.9,19.41 107.44,19.22 | 106.9,19.41 107.44,19.6 | 106.9,19.41 107.44,19.22 | v107.51,19.41 107.44,19.22 | 106.9,19.41 107.44,19.6 | v107.51,19.41 107.44,19.6
  Top 0.813: v16.53,52.09 15.26,53.36 | v13.99,54.63 U7.1
  Top 1.016: 87.47,43.26 87.47,43.18 86.2,43.18 | 87.47,43.26 v87.63,43.26 | 87.47,43.26 87.47,44.45
  GND 0.254: v88.67,24.77 89.28,24.77 | 89.28,24.77 89.53,24.77 | v103.73,30.7 104.31,30.54 | 104.31,30.54 104.56,30.47 | 89.28,24.77 88.79,25.01 | 88.79,25.01 | 89.28,24.77 88.79,24.52 | 88.79,24.52 | 89.28,24.77 88.79,25.01 | 88.79,25.01 | 89.28,24.77 88.79,24.52 | v88.67,24.77 88.79,24.52 | 89.28,24.77 88.79,25.01 | v88.67,24.77 88.79,25.01 | 89.28,24.77 88.79,24.52 | v88.67,24.77 88.79,24.52 | 104.31,30.54 103.92,30.91 v103.73,30.7 | 104.31,30.54 103.78,30.43 v103.73,30.7